# EasyEDA Pro project Signal Relay Switch.eprj

# Schematic Schematic1
Board Name: Integrated Signal Switch; Create Date: 2026-02-26; Page Name: P1; Project Name: Signal Relay Switch; Schematic Name: Schematic1; Update Date: 2026-02-25; Company: EasyEDA.com; Page Size: A4; Version: V1.0
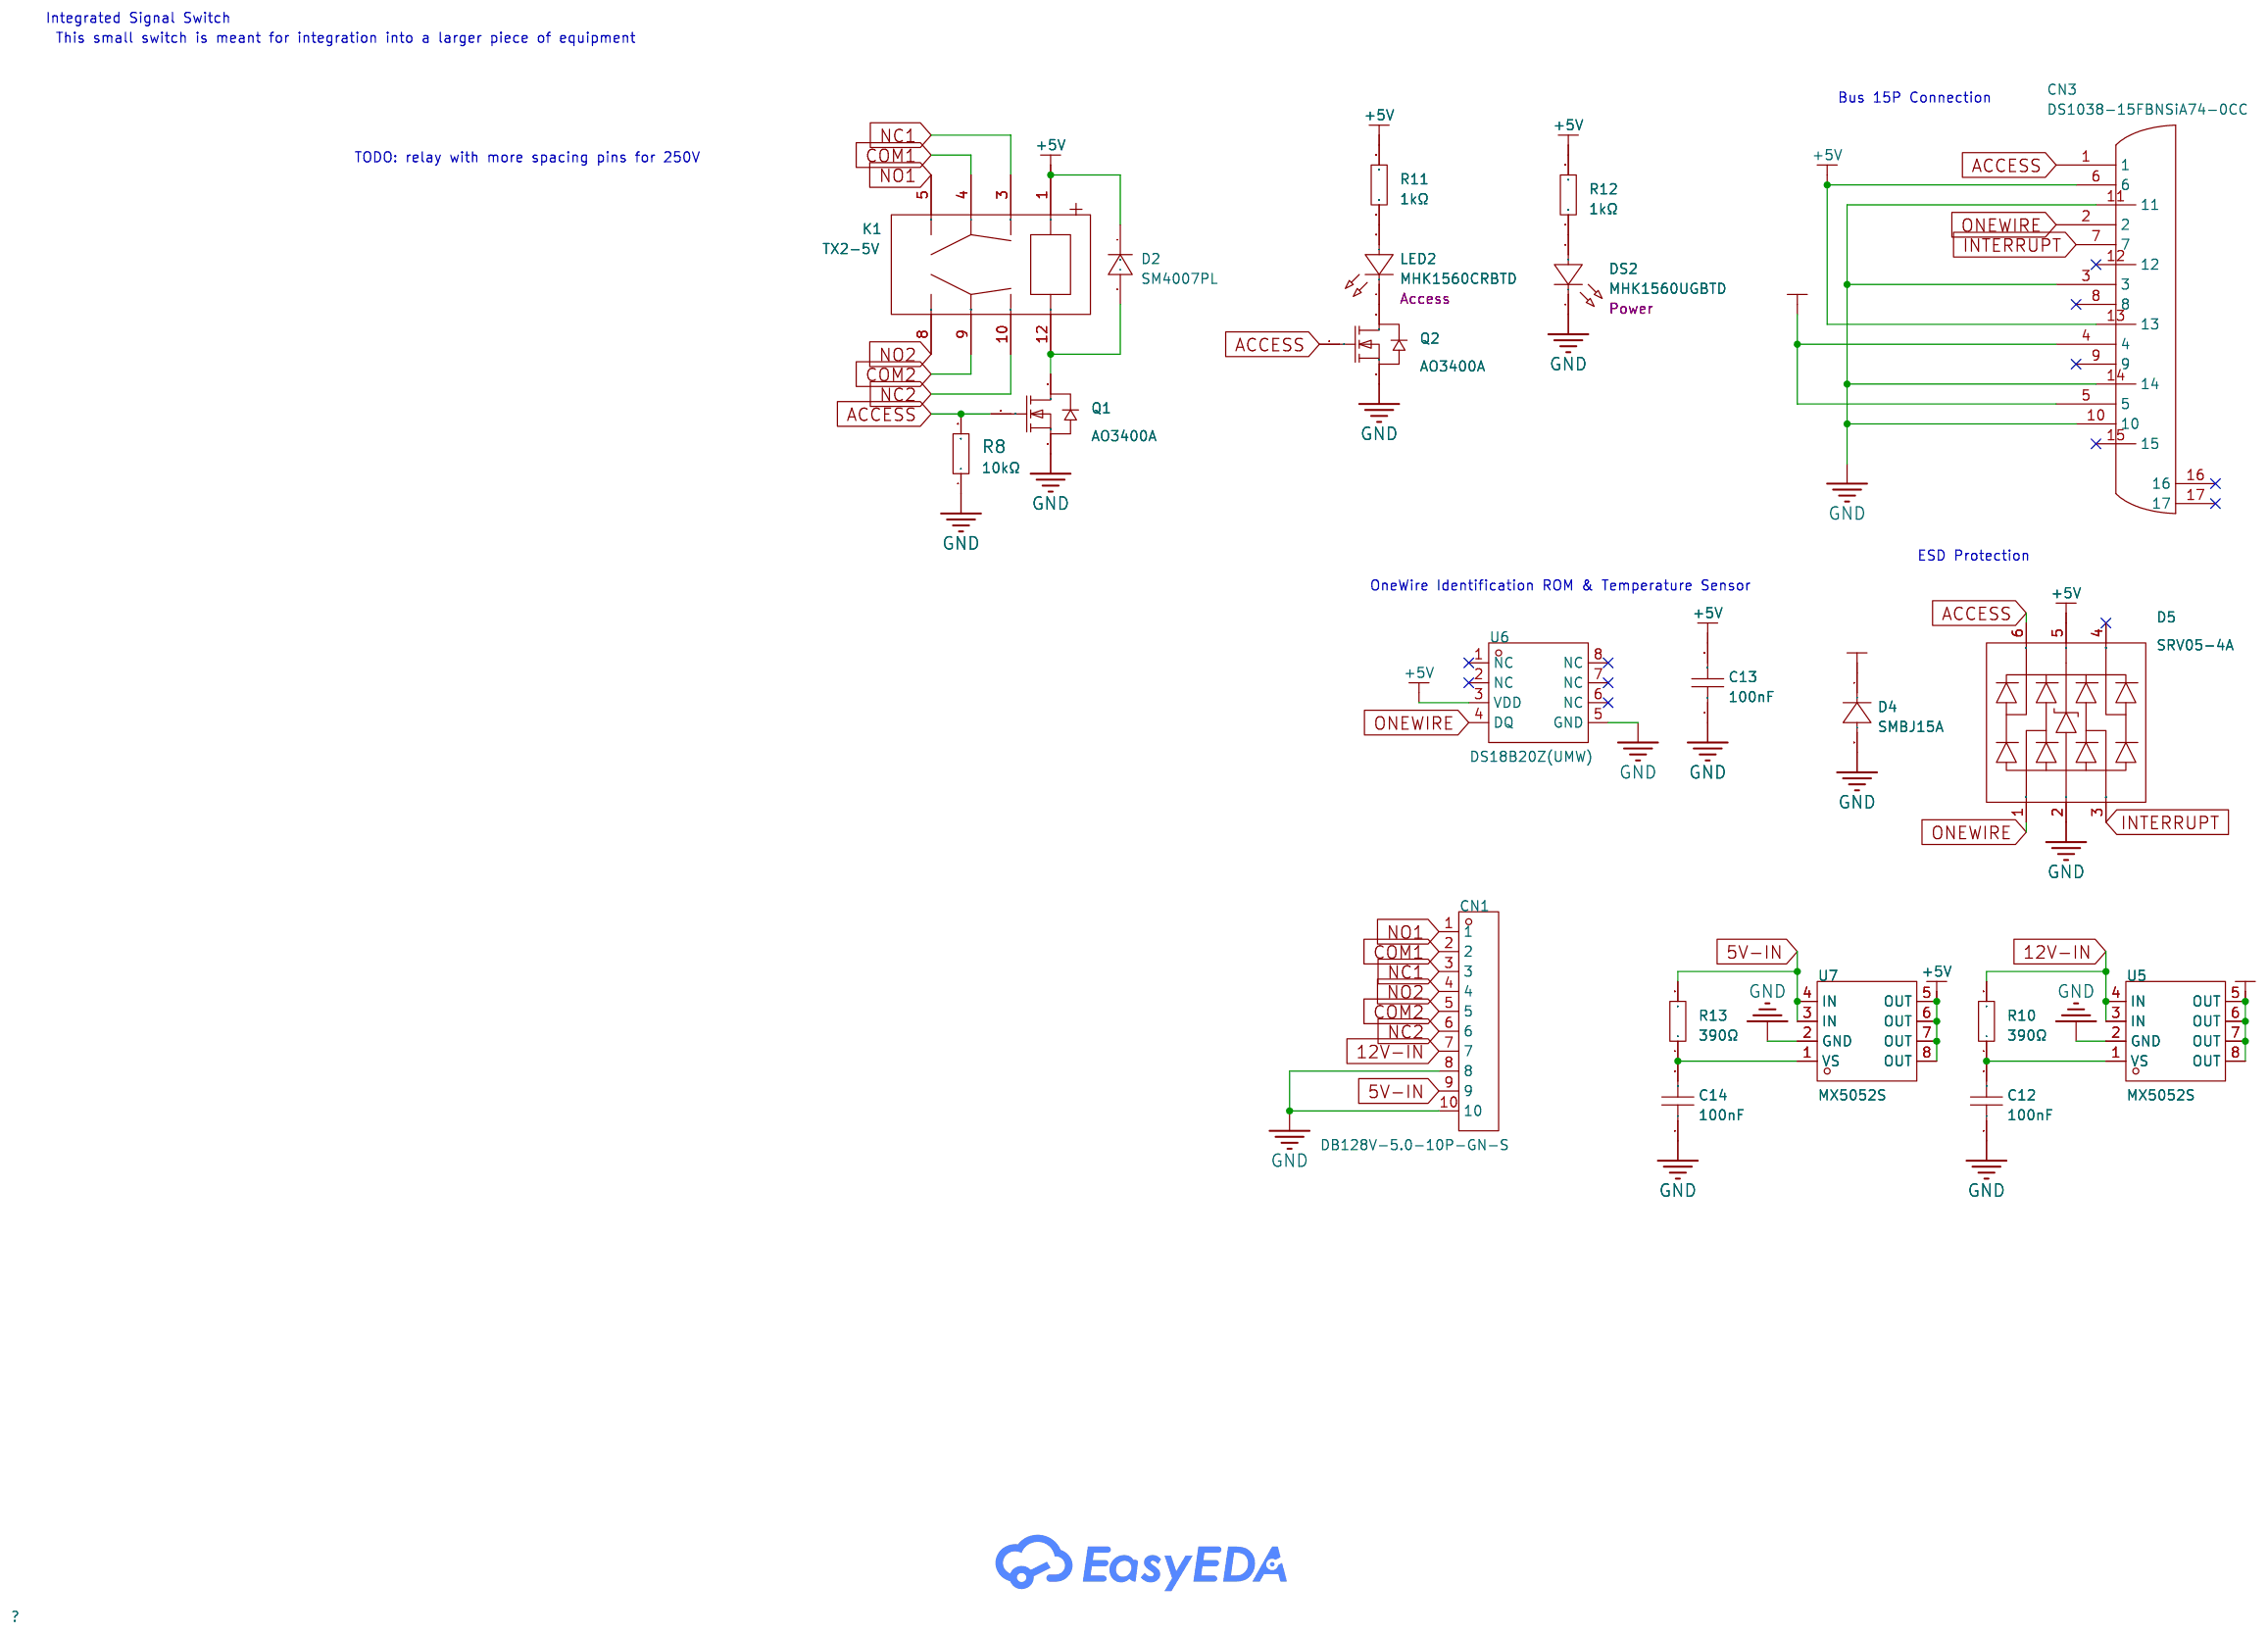
[diagram p0: schematic sheet]

## Parts
C12  100nF  [C0603]
C13  100nF  [C0603]
C14  100nF  [C0603]
CN1  DB128V-5.0-10P-GN-S  [CONN-TH_DB128V-5.0-10P-GN-S]
CN3  DS1038-15FBNSiA74-0CC  [DSUB-TH_DS1038-15FBNSIA74-0CC]
D2  SM4007PL  [SOD-123F_L2.8-W1.8-LS3.7-RD]
D4  SMBJ15A  [SMB_L4.3-W3.6-LS5.3-RD]
D5  SRV05-4A  [SOT-23-6_L2.9-W1.6-P0.95-LS2.9-BL]
DS2  MHK1560UGBTD  [LED-TH_MHK1560UGBTD]
K1  TX2-5V  [RELAY-TH_TX2-3V]
LED2  MHK1560CRBTD  [LED-TH_L12.2-W6.0-P2.54]
Q1  AO3400A  [SOT-23-3_L2.9-W1.3-P1.90-LS2.4-BR]
Q2  AO3400A  [SOT-23-3_L2.9-W1.3-P1.90-LS2.4-BR]
R8  10kΩ  [R0603]
R10  390Ω  [R0805]
R11  1kΩ  [R0603]
R12  1kΩ  [R0603]
R13  390Ω  [R0805]
U5  MX5052S  [SOP-8_L4.9-W3.9-P1.27-LS6.0-BL]
U6  DS18B20Z(UMW)  [SOP-8_L4.9-W3.9-P1.27-LS6.0-BL]
U7  MX5052S  [SOP-8_L4.9-W3.9-P1.27-LS6.0-BL]

## Library data of the parts
C12-C14 = CC0603KRX7R9BB104: Capacitance:100nF Tolerance:±10% Tolerance:±10% Voltage Rating:50V Temperature Coefficient:X7R; LCSC Part Name: 100nF ±10% 50V; Supplier Part: C14663; Manufacturer: YAGEO(国巨); Supplier Footprint: 0603; Datasheet: https://item.szlcsc.com/datasheet/CC0603KRX7R9BB104/15331.html; Supplier: LCSC; Tolerance: ±10%; Voltage Rating: 50V; Temperature Coefficient: X7R
CN1 = DB128V-5.0-10P-GN-S: LCSC Part Name: 1x10P 5mm 直插 排数:1 每排P数:10; Supplier Part: C725714; Manufacturer: DORABO(地博电气); Supplier Footprint: 插件,P=5mm; JLCPCB Part Class: Extended Part; Datasheet: https://item.szlcsc.com/datasheet/DB128V-5.0-10P-GN-S/772606.html; Supplier: LCSC; Number of Positions or Pins: 1x10P; Pitch: 5mm; Color: Green; Mounting Type: Through Hole; Number of Pins: 10P; Number of Rows: 1; Number of PINs Per Row: 10; Screw Specification: M2.5; Current Rating: 16A; Voltage Rating (Max): 300V; Wire Gauge - AWG: 12~22; Wire Gauge - mm2: 2.5; Operating Temperature: -40℃~+105℃
CN3 = DS1038-15FBNSiA74-0CC: Connector Type:High Density D-Sub Gender:Female Number of Pins:15P Mounting Type:Right Angle Number of Rows:3 Current Rating-Signal:3A Current Rating-Power:- Voltage Rating:- Color:Black Operating Temperature:-40℃~+105℃ Operating Temperature:-40℃~+105℃; LCSC Part Name: 黑色 1000/盒 D-Sub 母 P数:15P; Supplier Part: C75754; Manufacturer: CONNFLY; Supplier Footprint: 弯插; JLCPCB Part Class: Extended Part; Datasheet: https://item.szlcsc.com/datasheet/DS1038-15FBNSiA74-0CC/76880.html; Supplier: LCSC; Connector Type: High Density D-Sub; Gender: Female; Number of Pins: 15P; Mounting Type: Right Angle; Number of Rows: 3; Current Rating-Signal: 3A; Color: Black; Operating Temperature: -40℃~+105℃
D2 = SM4007PL_C64898: Diode Configuration:Independent Voltage - Forward(Vf@If):1.1V@1A Voltage - DC Reverse(Vr):1kV Current - Rectified:1A Reverse Leakage Current (Ir):10uA@1kV Non-Repetitive Peak Forward Surge Current:25A Operating Junction Temperature Range:-55℃~+150℃ Operat; LCSC Part Name: 1kV 1A; Supplier Part: C64898; Manufacturer: MDD(辰达半导体); Supplier Footprint: SOD-123FL; Datasheet: https://item.szlcsc.com/datasheet/SM4007PL/65968.html; Supplier: LCSC; Diode Configuration: Independent; Voltage - Forward(Vf@If): 1.1V@1A; Voltage - DC Reverse(Vr): 1kV; Current - Rectified: 1A; Reverse Leakage Current (Ir): 10uA@1kV; Non-Repetitive Peak Forward Surge Current: 25A; Operating Junction Temperature Range: -55℃~+150℃
D4 = SMBJ15A_C19077569: Polarity:Unidirectional Reverse Stand-Off Voltage (Vrwm):15V Clamping Voltage:24.4V Peak Pulse Current (Ipp):24.59A@10/1000us Peak Pulse Power Dissipation (Ppp):600W@10/1000us Voltage - Breakdown:18.5V Reverse Leakage Current (Ir):5uA Operating Temperatur; LCSC Part Name: 单向TVS 15V截止 峰值浪涌电流：24.59A@10/1000us; Supplier Part: C19077569; Manufacturer: R+O(宏嘉诚); Supplier Footprint: DO-214AA(SMB); JLCPCB Part Class: Extended Part; Datasheet: https://item.szlcsc.com/datasheet/SMBJ15A/20275654.html; Supplier: LCSC; Polarity: Unidirectional; Reverse Stand-Off Voltage (Vrwm): 15V; Clamping Voltage: 24.4V; Peak Pulse Current (Ipp): 24.59A@10/1000us; Peak Pulse Power Dissipation (Ppp): 600W@10/1000us; Voltage - Breakdown: 18.5V; Reverse Leakage Current (Ir): 5uA; Operating Temperature: -55℃~+150℃; level of protection: IEC 61000-4-2; Type: TVS
D5 = SRV05-4A_C20615829: Polarity:Unidirectional Reverse Stand-Off Voltage (Vrwm):5V Clamping Voltage:15V Peak Pulse Current (Ipp):4A@8/20us Peak Pulse Power Dissipation (Ppp):80W@8/20us Voltage - Breakdown:6V Reverse Leakage Current (Ir):5uA Operating Temperature:-55℃~+155℃ Oper; LCSC Part Name: 丝印:V05 单向ESD 5V截止 峰值浪涌电流：4A@8/20us; Supplier Part: C20615829; Manufacturer: R+O(宏嘉诚); Supplier Footprint: SOT-23-6L; JLCPCB Part Class: Extended Part; Datasheet: https://item.szlcsc.com/datasheet/SRV05-4A/21980004.html; Supplier: LCSC; Polarity: Unidirectional; Reverse Stand-Off Voltage (Vrwm): 5V; Clamping Voltage: 15V; Peak Pulse Current (Ipp): 4A@8/20us; Peak Pulse Power Dissipation (Ppp): 80W@8/20us; Voltage - Breakdown: 6V; Reverse Leakage Current (Ir): 5uA; Operating Temperature: -55℃~+155℃; level of protection: IEC 61000-4-5；IEC 61000-4-2; Type: ESD; Junction Capacitance: 0.5pF；1pF
DS2 = MHK1560UGBTD: Emitted Color:Emerald Forward Voltage (VF):1.75V~2.2V Forward Voltage (VF):1.75V~2.2V Forward Current:20mA Dominant Wavelength:520nm Dominant Wavelength:520nm Lens Color:雾状绿透镜 Luminous Intensity:1000mcd Luminous Intensity:1000mcd Viewing Angle:85° Operati; LCSC Part Name: 1560直插单灯翠绿色光; Supplier Part: C7470833; Manufacturer: MEIHUA(美华); Supplier Footprint: 插件,P=2.54mm; JLCPCB Part Class: Extended Part; Datasheet: https://atta.szlcsc.com/upload/public/pdf/source/20231114/0151DB1F997DCF286213A722D08B4BAA.pdf; Supplier: LCSC; Emitted Color: Emerald; Forward Voltage (VF): 1.75V~2.2V; Forward Current: 20mA; Dominant Wavelength: 520nm; Lens Color: 雾状绿透镜; Luminous Intensity: 1000mcd; Viewing Angle: 85°; Operating Temperature: -40℃~+85℃; Note: Power
K1 = TX2-5V: LCSC Part Name: 5V 2A 两组转换:2C(双刀双掷转换); Supplier Part: C192257; Manufacturer: PANASONIC(松下); Supplier Footprint: DIP,15x7.4mm; JLCPCB Part Class: Extended Part; Datasheet: https://item.szlcsc.com/datasheet/TX2-5V/221005.html; Supplier: LCSC; Coil Voltage: 5V; Contact Form: Two groups of conversions: 2C(Double-pole double-throw conversion); Contact Rating: 2A@30VDC；500mA@125VAC; Switching Voltage(Max): 220V@DC; Contact Material: Silver + Gold Plated; Coil Rated Power: 140mW; Coil Resistance: 178Ω; Switching Current(Max): 2A; Operate Time: 4ms; Release Time: 4ms; Contact Resistance: 100mΩ; Operating Temperature: -40℃~+85℃
LED2 = MHK1560CRBTD: Illumination Color:Red Voltage - Forward(Vf):1.75V~2.2V Voltage - Forward(Vf):1.75V~2.2V Power(Watts):80mW Forward Current:20mA Wavelength - Dominant:632nm Wavelength - Dominant:632nm Lens Color:Diffused Red Lens Luminous Intensity:50mcd Luminous Intensit; LCSC Part Name: 1560直插单灯红色光; Supplier Part: C7470835; Manufacturer: MEIHUA(美华); Supplier Footprint: 插件,P=2.54mm; JLCPCB Part Class: Extended Part; Datasheet: https://item.szlcsc.com/datasheet/MHK1560CRBTD/8521940.html; Supplier: LCSC; Illumination Color: Red; Voltage - Forward(Vf): 1.75V~2.2V; Power(Watts): 80mW; Forward Current: 20mA; Wavelength - Dominant: 632nm; Lens Color: Diffused Red Lens; Luminous Intensity: 50mcd; Viewing Angle: 85°; Operating Temperature: -40℃~+85℃; Note: Access
Q1 Q2 = AO3400A_C20917: Number:- Drain to Source Voltage:30V Current - Continuous Drain(Id):- RDS(on):48mΩ@2.5V Pd - Power Dissipation:- Gate Threshold Voltage (Vgs(th)):1.45V@250uA Gate Charge(Qg):7nC@10V Input Capacitance(Ciss):630pF@15V Reverse Transfer Capacitance (Crss@Vds); LCSC Part Name: 1个N沟道 耐压:30V 电流:5.7A; Supplier Part: C20917; Manufacturer: AOS; Supplier Footprint: SOT-23-3L; Datasheet: https://item.szlcsc.com/datasheet/AO3400A/21629.html; Supplier: LCSC; Drain to Source Voltage: 30V; RDS(on): 48mΩ@2.5V; Gate Threshold Voltage (Vgs(th)): 1.45V@250uA; Gate Charge(Qg): 7nC@10V; Input Capacitance(Ciss): 630pF@15V; Operating Temperature: -55℃~+150℃@(Tj); Type: N-Channel
R8 = 0603WAF1002T5E: Type:Thick Film Resistor Resistance:10kΩ Tolerance:±1% Tolerance:±1% Power(Watts):100mW Voltage-Supply(Max):75V Temperature Coefficient:±100ppm/℃ Temperature Coefficient:±100ppm/℃ Operating Temperature:-55℃~+155℃ Operating Temperature:-55℃~+155℃; LCSC Part Name: 厚膜电阻 10kΩ ±1% 100mW; Supplier Part: C25804; Manufacturer: UNI-ROYAL(厚声); Supplier Footprint: 0603; JLCPCB Part Class: Basic Part; Datasheet: https://item.szlcsc.com/datasheet/0603WAF1002T5E/26547.html; Supplier: LCSC; Type: Thick Film Resistor; Tolerance: ±1%; Power(Watts): 100mW; Voltage-Supply(Max): 75V; Temperature Coefficient: ±100ppm/℃; Operating Temperature: -55℃~+155℃
R10 R13 = 0805W8F3900T5E: Type:Thick Film Resistor Resistance:390Ω Tolerance:±1% Tolerance:±1% Power(Watts):125mW Voltage-Supply(Max):150V Temperature Coefficient:±100ppm/℃ Temperature Coefficient:±100ppm/℃ Operating Temperature:-55℃~+155℃ Operating Temperature:-55℃~+155℃; LCSC Part Name: 390Ω ±1% 125mW 厚膜电阻; Supplier Part: C17655; Manufacturer: UNI-ROYAL(厚声); Supplier Footprint: 0805; Datasheet: https://item.szlcsc.com/datasheet/0805W8F3900T5E/18343.html; Supplier: LCSC; Type: Thick Film Resistor; Tolerance: ±1%; Power(Watts): 125mW; Voltage-Supply(Max): 150V; Temperature Coefficient: ±100ppm/℃; Operating Temperature: -55℃~+155℃
R11 R12 = 0603WAF1001T5E: Type:Thick Film Resistor Resistance:1kΩ Tolerance:±1% Tolerance:±1% Power(Watts):100mW Voltage-Supply(Max):75V Temperature Coefficient:±100ppm/℃ Temperature Coefficient:±100ppm/℃ Operating Temperature:-55℃~+155℃ Operating Temperature:-55℃~+155℃; LCSC Part Name: 1kΩ ±1% 100mW 厚膜电阻; Supplier Part: C21190; Manufacturer: UNI-ROYAL(厚声); Supplier Footprint: 0603; Datasheet: https://item.szlcsc.com/datasheet/0603WAF1001T5E/21904.html; Supplier: LCSC; Type: Thick Film Resistor; Tolerance: ±1%; Power(Watts): 100mW; Voltage-Supply(Max): 75V; Temperature Coefficient: ±100ppm/℃; Operating Temperature: -55℃~+155℃
U5 U7 = MX5052S: LCSC Part Name: 集成MOS Oring控制器; Supplier Part: C5875696; Manufacturer: Wuxi Maxinmicro(无锡明芯微); Supplier Footprint: SOP-8; JLCPCB Part Class: Extended Part; Datasheet: https://item.szlcsc.com/datasheet/MX5052S/6809525.html; Supplier: LCSC
U6 = DS18B20Z(UMW): Temperature range:- Temperature range:- Resolution:±0.4℃ Resolution:±0.4℃ Supply Voltage:2.5V~5.5V Supply Voltage:2.5V~5.5V; LCSC Part Name: 温度传感器; Supplier Part: C695837; Manufacturer: UMW(友台半导体); Supplier Footprint: SOIC-8; JLCPCB Part Class: Extended Part; Datasheet: https://atta.szlcsc.com/upload/public/pdf/source/20241210/329D6A12FB6ADF2EBB286F6D44242ED4.pdf; Supplier: LCSC; Resolution: ±0.4℃; Supply Voltage: 2.5V~5.5V

## Nets
5V-IN: CN1.9 R13.2 U7.3(IN) U7.4(IN)
12V-IN: CN1.7 R10.2 U5.3(IN) U5.4(IN)
+5V: C13.2 CN3.6 CN3.13 D2.1(C) D5.5(VP) K1.1 R11.2 R12.2 U6.3(VDD) U7.5(OUT) U7.6(OUT) U7.7(OUT) U7.8(OUT)
+12V: CN3.4 CN3.5 D4.1(K) U5.5(OUT) U5.6(OUT) U5.7(OUT) U5.8(OUT)
GND: C12.1 C13.1 C14.1 CN1.8 CN1.10 CN3.3 CN3.10 CN3.11 CN3.14 D4.2(A) D5.2(VN) DS2.1(K) Q1.2(S) Q2.2(S) R8.1 U5.2(GND) U6.5(GND) U7.2(GND)
ACCESS: CN3.1 D5.6(I/O) Q1.1(G) Q2.1(G) R8.2
COM1: CN1.2 K1.4
COM2: CN1.5 K1.9
INTERRUPT: CN3.7 D5.3(I/O)
NC1: CN1.3 K1.3
NC2: CN1.6 K1.10
NO1: CN1.1 K1.5
NO2: CN1.4 K1.8
ONEWIRE: CN3.2 D5.1(I/O) U6.4(DQ)
$1N583: LED2.2(A) R11.1
$1N584: LED2.1(K) Q2.3(D)
$1N868: DS2.2(A) R12.1
$1N1247: D2.2(A) K1.12 Q1.3(D)
$1N1638: C12.2 R10.1 U5.1(VS)
$1N1806: C14.2 R13.1 U7.1(VS)

Not connected (* = marked no-connect by the designer): CN3 8* 9* 12* 15* 16* 17*; D5 4(I/O)*; U6 1(NC)* 2(NC)* 6(NC)* 7(NC)* 8(NC)*

## Notes on the sheet
- Integrated Signal Switch
- This small switch is meant for integration into a larger piece of equipment
- Bus 15P Connection
- TODO: relay with more spacing pins for 250V
- ESD Protection
- OneWire Identification ROM & Temperature Sensor

# Board PCB1
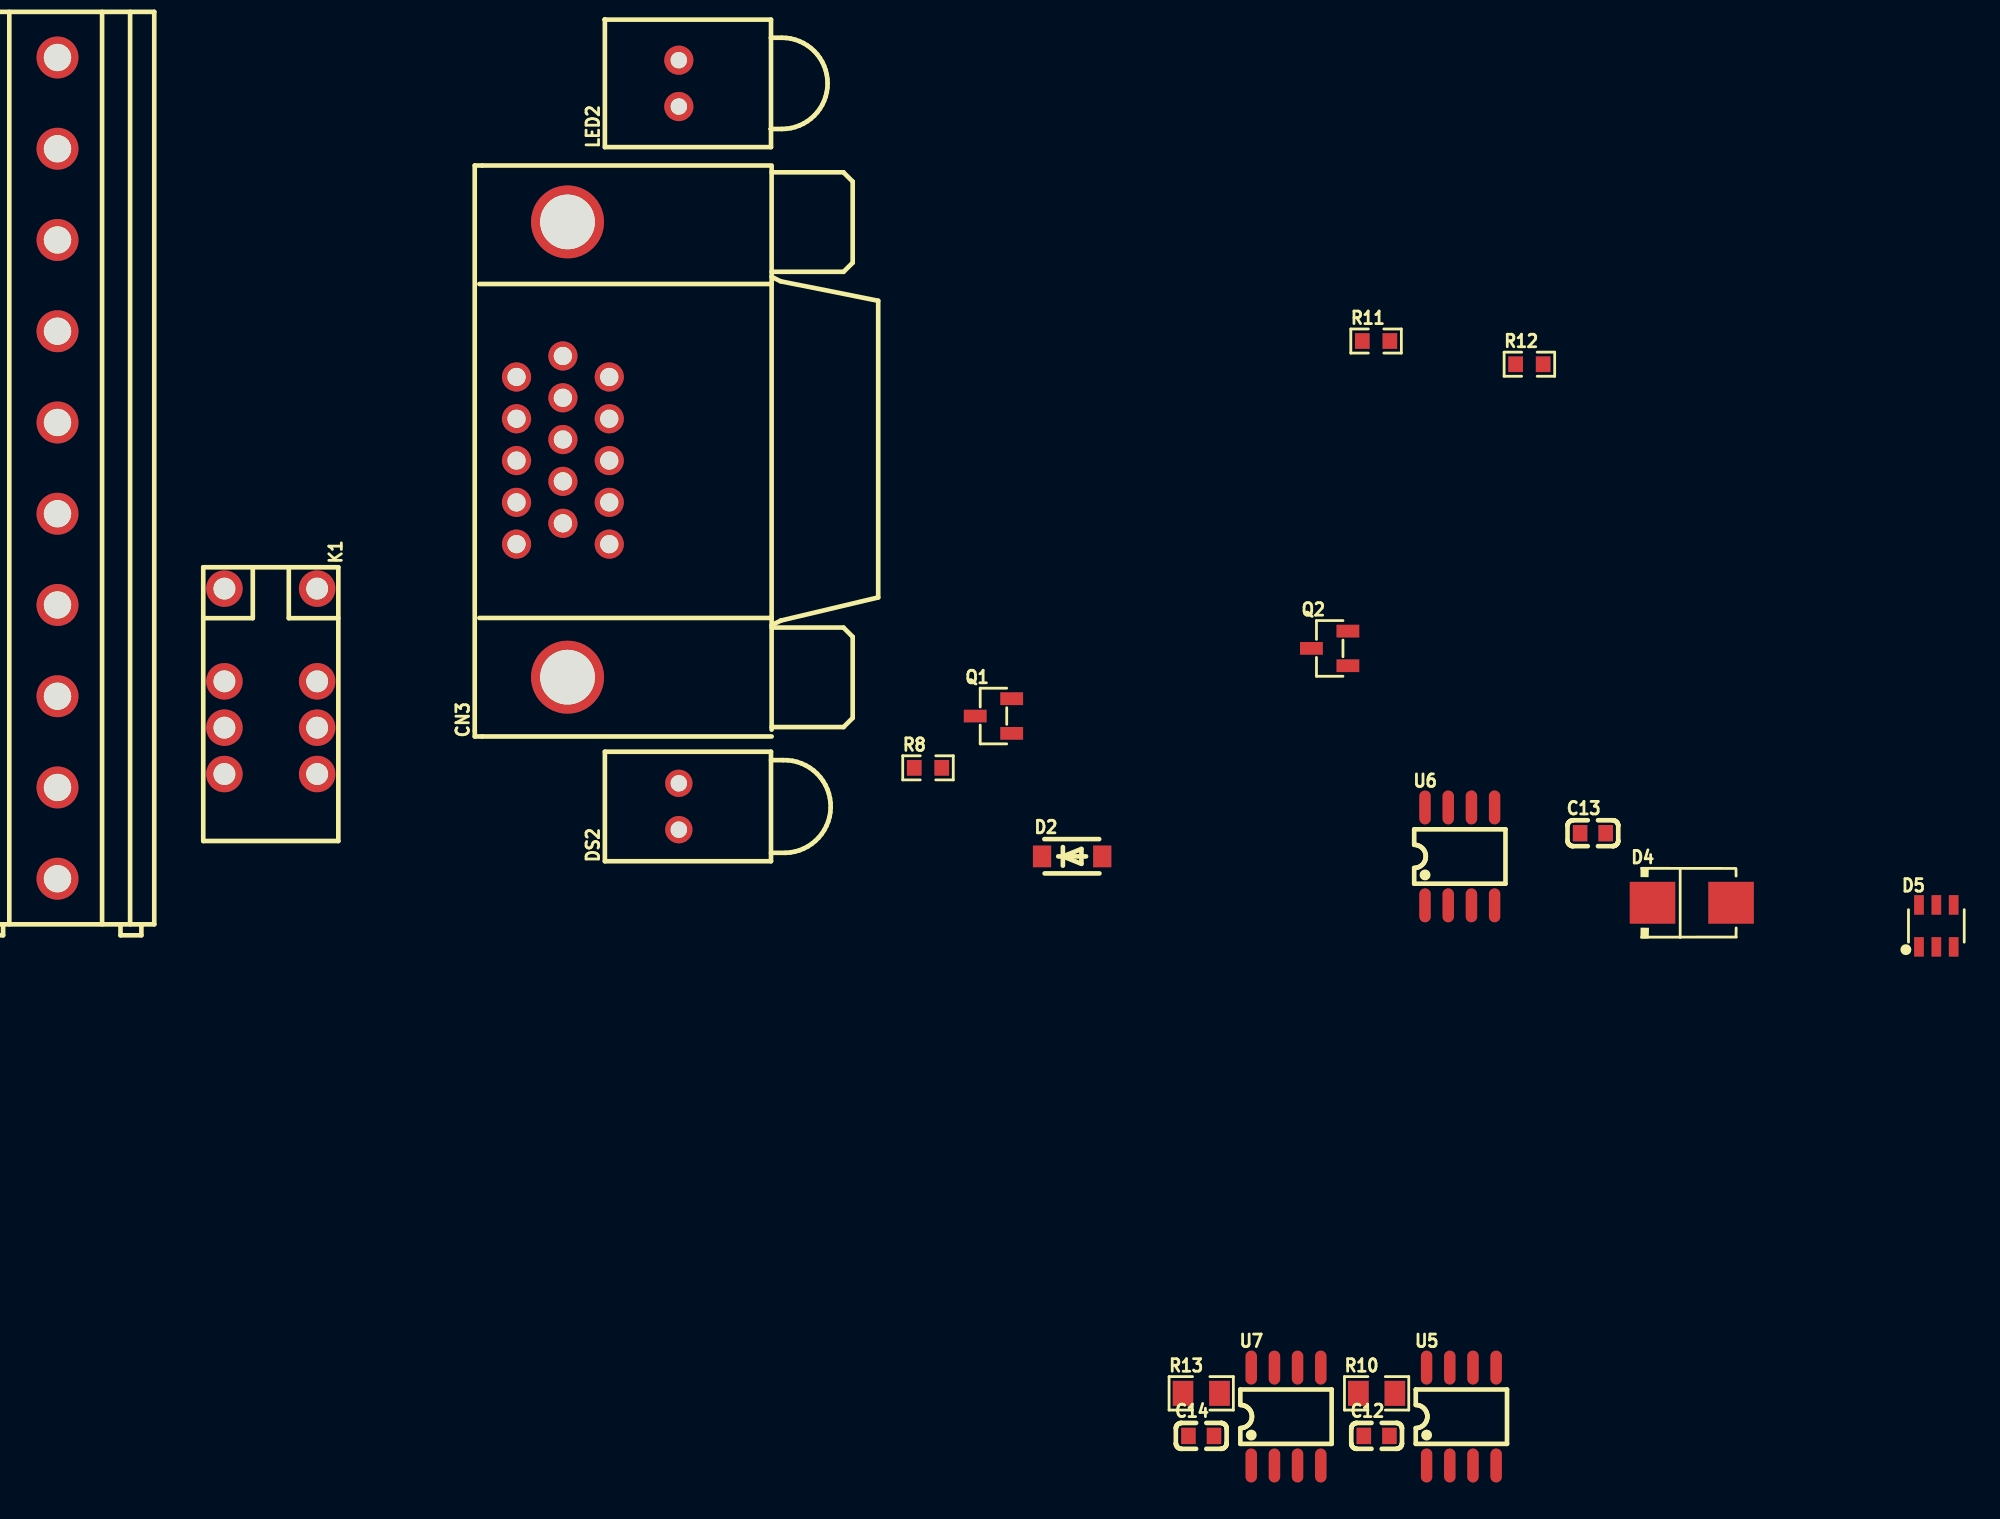
[diagram p1: board, top side]
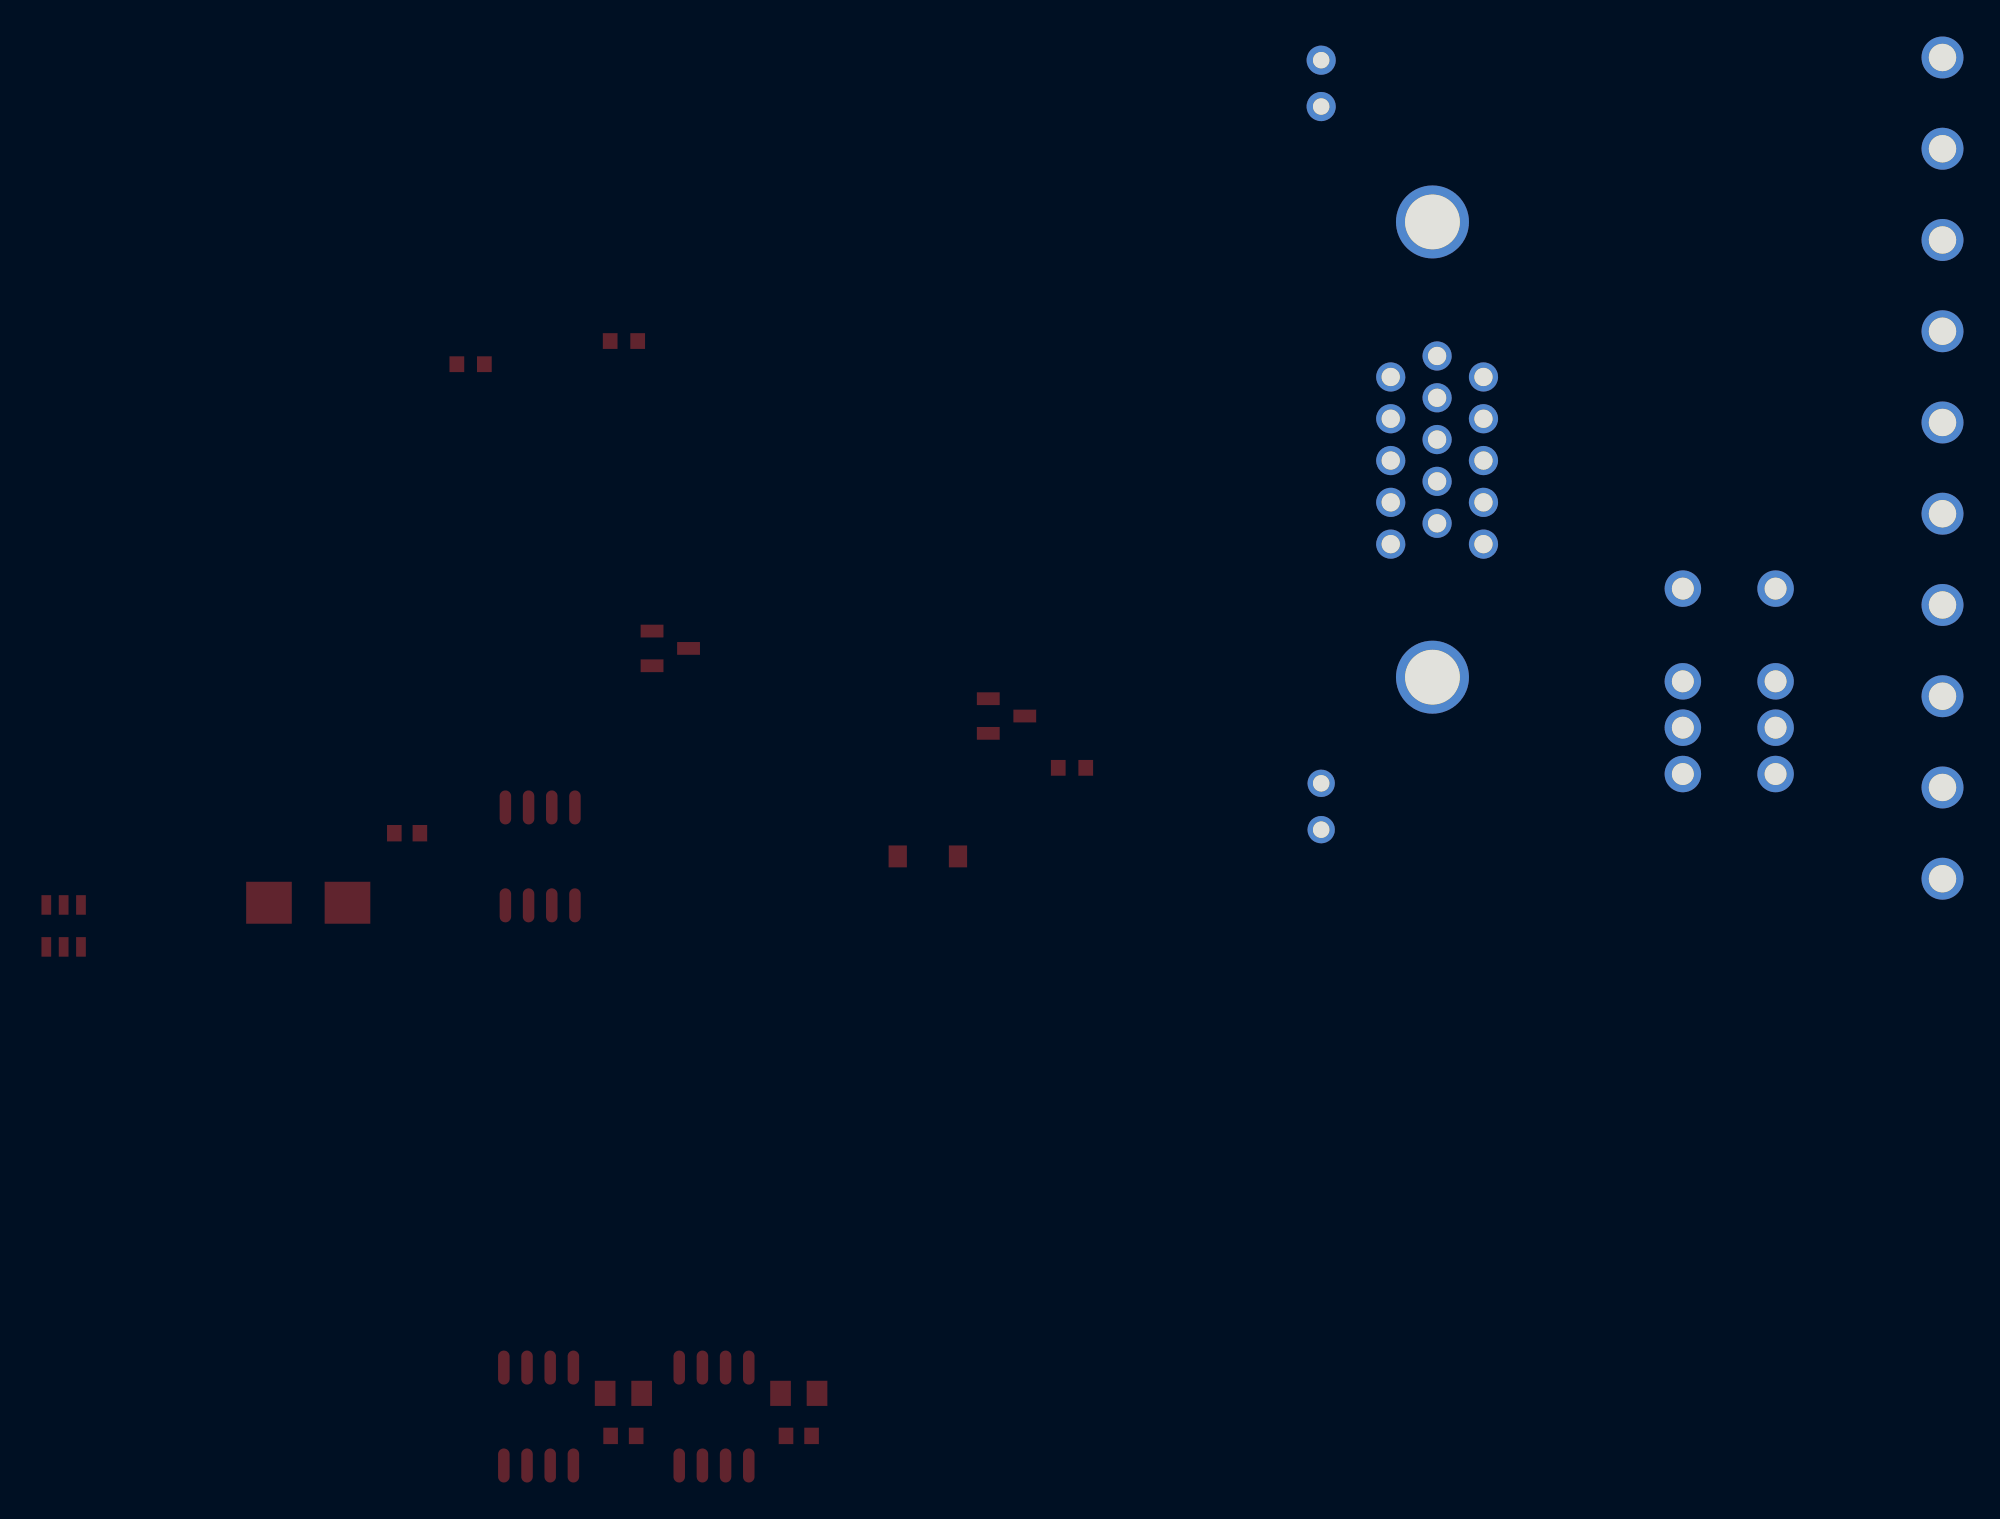
[diagram p2: board, bottom side, seen from below]

No outline. copper layers: Top Layer, Bottom Layer. Coordinates in mm from the lowest, leftmost part position.
Stack: Top Layer 0.035mm / Dielectric1 1.51mm FR4 er 4.5 / Bottom Layer 0.035mm

## Design rules (mm)
template: JLCPCB Capability(Two Layers Board)
spacing copperThickness1oz (default): track to track 0.102, other pairs 0.152 to 0.3
spacing copperThickness2oz: track to track 0.203, other pairs 0.152 to 0.3
track width copperThickness1oz (default): min 0.127, default 0.254, max 2.54
track width copperThickness2oz: min 0.203, default 0.254, max 2.54
differential pair differentialPair (default): width min 0.127, default 0.254, max 2.54; gap min 0.152, default 0.152
via viaSize (default): diameter min 0.5, default 0.61, max 10; hole min 0.3, default 0.305, max 6.3

## Placement (name value [footprint] x y rotation side)
C12  100nF  [C0603]  72.26 0 0 top
C13  100nF  [C0603]  84.11 33.02 0 top
C14  100nF  [C0603]  62.65 0 0 top
CN1  DB128V-5.0-10P-GN-S  [CONN-TH_DB128V-5.0-10P-GN-S]  0 53.03 90 top
CN3  DS1038-15FBNSiA74-0CC  [DSUB-TH_DS1038-15FBNSIA74-0CC]  27.69 54.05 90 top
D2  SM4007PL  [SOD-123F_L2.8-W1.8-LS3.7-RD]  55.58 31.75 0 top
D4  SMBJ15A  [SMB_L4.3-W3.6-LS5.3-RD]  89.53 29.21 0 top
D5  SRV05-4A  [SOT-23-6_L2.9-W1.6-P0.95-LS2.9-BL]  102.92 27.94 0 top
DS2  MHK1560UGBTD  [LED-TH_MHK1560UGBTD]  34.04 34.49 90 top
K1  TX2-5V  [RELAY-TH_TX2-3V]  11.68 41.35 270 top
LED2  MHK1560CRBTD  [LED-TH_L12.2-W6.0-P2.54]  34.04 74.11 90 top
Q1  AO3400A  [SOT-23-3_L2.9-W1.3-P1.90-LS2.4-BR]  51.27 39.44 0 top
Q2  AO3400A  [SOT-23-3_L2.9-W1.3-P1.90-LS2.4-BR]  69.69 43.15 0 top
R8  10kΩ  [R0603]  47.69 36.61 0 top
R10  390Ω  [R0805]  72.26 2.33 0 top
R11  1kΩ  [R0603]  72.23 59.99 0 top
R12  1kΩ  [R0603]  80.63 58.72 0 top
R13  390Ω  [R0805]  62.65 2.33 0 top
U5  MX5052S  [SOP-8_L4.9-W3.9-P1.27-LS6.0-BL]  76.91 1.06 0 top
U6  DS18B20Z(UMW)  [SOP-8_L4.9-W3.9-P1.27-LS6.0-BL]  76.82 31.75 0 top
U7  MX5052S  [SOP-8_L4.9-W3.9-P1.27-LS6.0-BL]  67.3 1.06 0 top

## Footprints (pads in the part's own frame, mm; a bottom-side part is the same pattern mirrored in y, then rotated)
C0603
  rect 0.8x0.9 smd: 1(-0.7,0) 2(0.7,0)
CONN-TH_DB128V-5.0-10P-GN-S
  round 2.3 hole 1.5: 1(-22.5,0) 2(-17.5,0) 3(-12.5,0) 4(-7.5,0) 5(-2.5,0) 6(2.5,0) 7(7.5,0) 8(12.5,0) 9(17.5,0) 10(22.5,0)
DSUB-TH_DS1038-15FBNSIA74-0CC
  round 1.6 hole 1: 1(3.978,2.54) 2(1.688,2.54) 3(-0.603,2.54) 4(-2.893,2.54) 5(-5.182,2.54) 6(5.128,0) 7(2.837,0) 8(0.548,0) 9(-1.743,0) 10(-4.042,0) 11(3.978,-2.54) 12(1.688,-2.54) 13(-0.603,-2.54) 14(-2.893,-2.54) 15(-5.182,-2.54)
  round 4 hole 3: 16(12.473,-0.254) 17(-12.473,-0.254)
LED-TH_L12.2-W6.0-P2.54
  round 1.6 hole 0.9: 1(-1.27,0) 2(1.27,0)
LED-TH_MHK1560UGBTD
  round 1.5 hole 0.9: 1(1.27,0) 2(-1.27,0)
R0603
  rect 0.806x0.864 smd: 1(-0.753,0) 2(0.753,0)
R0805
  rect 1.133x1.377 smd: 1(-1,0) 2(1,0)
RELAY-TH_TX2-3V
  round 2 hole 1.2: 1(-5.08,-2.54) 3(0,-2.54) 4(2.54,-2.54) 5(5.08,-2.54) 8(5.08,2.54) 9(2.54,2.54) 10(0,2.54) 12(-5.08,2.54)
SMB_L4.3-W3.6-LS5.3-RD
  rect 2.5x2.3 smd: 1(-2.15,0) 2(2.15,0)
SOD-123F_L2.8-W1.8-LS3.7-RD
  rect 1x1.2 smd: 1(-1.65,0) 2(1.65,0)
SOP-8_L4.9-W3.9-P1.27-LS6.0-BL
  oval 0.63x1.865 smd: 1(-1.905,-2.683) 2(-0.635,-2.683) 3(0.635,-2.683) 4(1.905,-2.683) 5(1.905,2.683) 6(0.635,2.683) 7(-0.635,2.683) 8(-1.905,2.683)
SOT-23-3_L2.9-W1.3-P1.90-LS2.4-BR
  rect 1.25x0.7 smd: 1(1,-0.95) 2(1,0.95) 3(-1,0)
SOT-23-6_L2.9-W1.6-P0.95-LS2.9-BL
  rect 0.532x1.072 smd: 1(-0.95,-1.149) 2(0,-1.149) 3(0.95,-1.149) 4(0.95,1.149) 5(0,1.149) 6(-0.95,1.149)

## Nets
As in the schematic.

Pads without a net: CN3 8 9 12 15 16 17; D5 4; U6 1 2 6 7 8
